# EAGLE design NSL_CylonII (EAGLE 5.10)

## Sheet 1 of 3
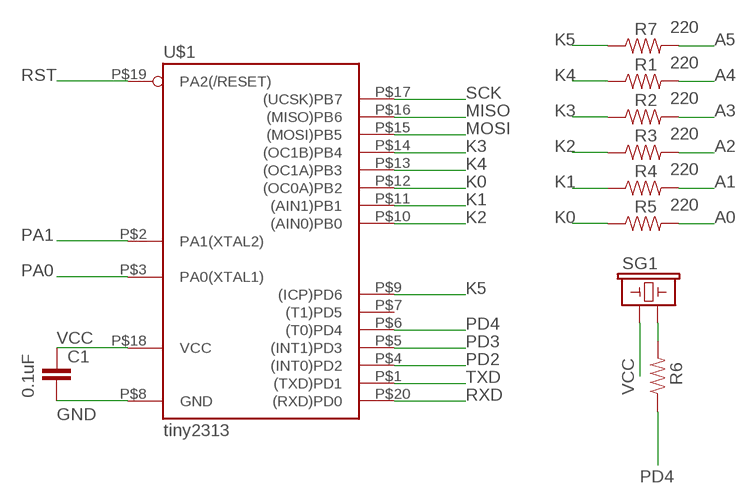
[diagram p0: schematic, sheet 1]

### Parts
C1  0.1uF  CAP0603-CAP  [0603-CAP]
R1  220  RESISTOR1206  [1206]
R2  220  RESISTOR1206  [1206]
R3  220  RESISTOR1206  [1206]
R4  220  RESISTOR1206  [1206]
R5  220  RESISTOR1206  [1206]
R6  RESISTOR1206  [1206]
R7  220  RESISTOR1206  [1206]
SG1  BUZZERSMD2  [BUZZER-CCV]
U$1  tiny2313  TINY2313-*M*  [MLF20]

### Nets
A0 [LED]: R5.2 ; also sheet 3
A1: R4.2 ; also sheet 3
A2: R3.2 ; also sheet 3
A3: R2.2 ; also sheet 3
A4: R1.2 ; also sheet 3
A5: R7.2 ; also sheet 3
GND: C1.2 U$1.P$8(GND) ; also sheet 2
K0 [LED]: R5.1 U$1.P$12((OC0A)PB2)
K1 [LED]: R4.1 U$1.P$11((AIN1)PB1)
K2 [LED]: R3.1 U$1.P$10((AIN0)PB0)
K3 [LED]: R2.1 U$1.P$14((OC1B)PB4)
K4 [LED]: R1.1 U$1.P$13((OC1A)PB3)
K5: R7.1 U$1.P$9((ICP)PD6)
MISO: U$1.P$16((MISO)PB6) ; also sheet 2
MOSI: U$1.P$15((MOSI)PB5) ; also sheet 2
N$4: R6.2 SG1.-
PA0: U$1.P$3(PA0(XTAL1)) ; also sheet 2
PA1: U$1.P$2(PA1(XTAL2)) ; also sheet 2
PD2: U$1.P$4((INT0)PD2) ; also sheet 2
PD3: U$1.P$5((INT1)PD3)
PD4: R6.1 U$1.P$6((T0)PD4)
RST: U$1.P$19(PA2(/RESET)) ; also sheet 2
RXD: U$1.P$20((RXD)PD0)
SCK: U$1.P$17((UCSK)PB7) ; also sheet 2
TXD: U$1.P$1((TXD)PD1)
VCC: C1.1 SG1.+ U$1.P$18(VCC) ; also sheet 2
Unconnected: U$1.P$7((T1)PD5)

## Sheet 2 of 3
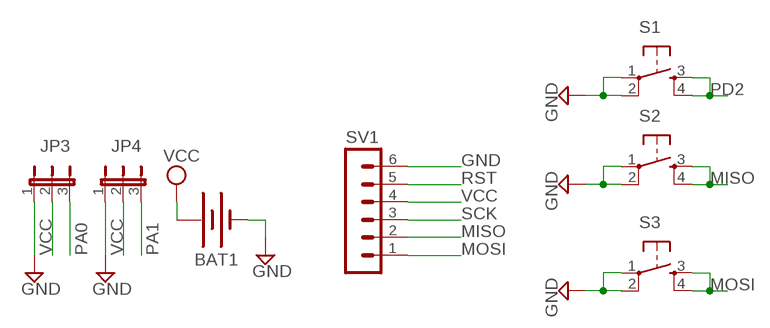
[diagram p1: schematic, sheet 2]

### Parts
BAT1  SPARKFUN_BATTERY20SMD  [SPARKFUN_BATTCON_20MM]
JP3  JUMPER-3PTH  [1X03]
JP4  JUMPER-3PTH  [1X03]
S1  TAC_SWITCHSMD  [TACTILE_SWITCH_SMD]
S2  TAC_SWITCHSMD  [TACTILE_SWITCH_SMD]
S3  TAC_SWITCHSMD  [TACTILE_SWITCH_SMD]
SV1  MA06-1  [MA06-1]

### Nets
GND: BAT1.2(-) JP3.1 JP4.1 S1.1 S1.2 S2.1 S2.2 S3.1 S3.2 SV1.6 ; also sheet 1
MISO: S2.3 S2.4 SV1.2 ; also sheet 1
MOSI: S3.3 S3.4 SV1.1 ; also sheet 1
PA0: JP3.3 ; also sheet 1
PA1: JP4.3 ; also sheet 1
PD2: S1.3 S1.4 ; also sheet 1
RST: SV1.5 ; also sheet 1
SCK: SV1.3 ; also sheet 1
VCC: BAT1.1(+) JP3.2 JP4.2 SV1.4 ; also sheet 1

## Sheet 3 of 3
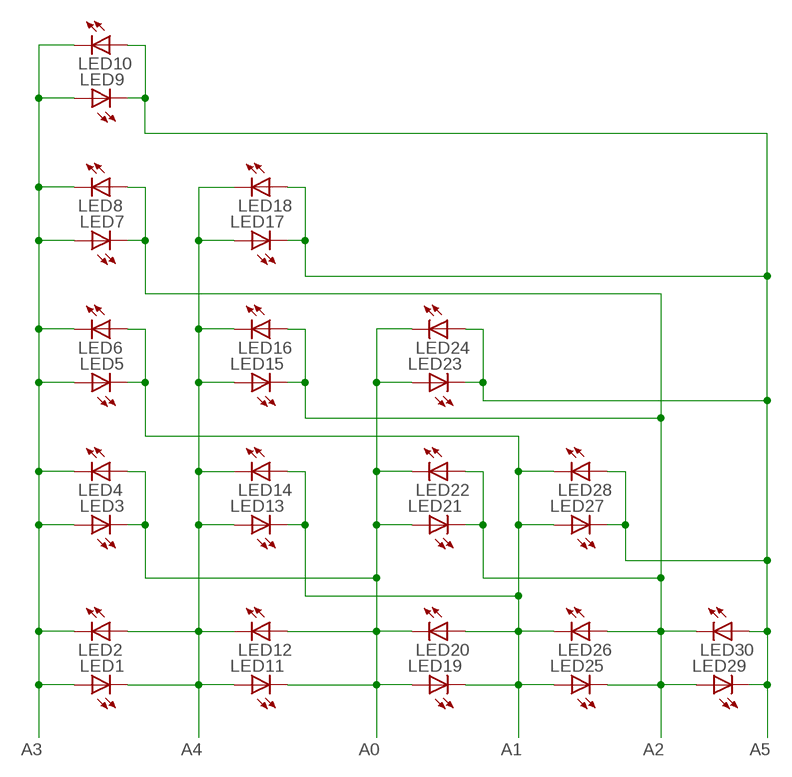
[diagram p2: schematic, sheet 3]

### Parts
LED1  LEDCHIPLED_1206  [CHIPLED_1206]
LED2  LEDCHIPLED_1206  [CHIPLED_1206]
LED3  LEDCHIPLED_1206  [CHIPLED_1206]
LED4  LEDCHIPLED_1206  [CHIPLED_1206]
LED5  LEDCHIPLED_1206  [CHIPLED_1206]
LED6  LEDCHIPLED_1206  [CHIPLED_1206]
LED7  LEDCHIPLED_1206  [CHIPLED_1206]
LED8  LEDCHIPLED_1206  [CHIPLED_1206]
LED9  LEDCHIPLED_1206  [CHIPLED_1206]
LED10  LEDCHIPLED_1206  [CHIPLED_1206]
LED11  LEDCHIPLED_1206  [CHIPLED_1206]
LED12  LEDCHIPLED_1206  [CHIPLED_1206]
LED13  LEDCHIPLED_1206  [CHIPLED_1206]
LED14  LEDCHIPLED_1206  [CHIPLED_1206]
LED15  LEDCHIPLED_1206  [CHIPLED_1206]
LED16  LEDCHIPLED_1206  [CHIPLED_1206]
LED17  LEDCHIPLED_1206  [CHIPLED_1206]
LED18  LEDCHIPLED_1206  [CHIPLED_1206]
LED19  LEDCHIPLED_1206  [CHIPLED_1206]
LED20  LEDCHIPLED_1206  [CHIPLED_1206]
LED21  LEDCHIPLED_1206  [CHIPLED_1206]
LED22  LEDCHIPLED_1206  [CHIPLED_1206]
LED23  LEDCHIPLED_1206  [CHIPLED_1206]
LED24  LEDCHIPLED_1206  [CHIPLED_1206]
LED25  LEDCHIPLED_1206  [CHIPLED_1206]
LED26  LEDCHIPLED_1206  [CHIPLED_1206]
LED27  LEDCHIPLED_1206  [CHIPLED_1206]
LED28  LEDCHIPLED_1206  [CHIPLED_1206]
LED29  LEDCHIPLED_1206  [CHIPLED_1206]
LED30  LEDCHIPLED_1206  [CHIPLED_1206]

### Nets
A0 [LED]: LED3.C LED4.A LED11.C LED12.A LED19.A LED20.C LED21.A LED22.C LED23.A LED24.C ; also sheet 1
A1: LED5.C LED6.A LED13.C LED14.A LED19.C LED20.A LED25.A LED26.C LED27.A LED28.C ; also sheet 1
A2: LED7.C LED8.A LED15.C LED16.A LED21.C LED22.A LED25.C LED26.A LED29.A LED30.C ; also sheet 1
A3: LED1.A LED2.C LED3.A LED4.C LED5.A LED6.C LED7.A LED8.C LED9.A LED10.C ; also sheet 1
A4: LED1.C LED2.A LED11.A LED12.C LED13.A LED14.C LED15.A LED16.C LED17.A LED18.C ; also sheet 1
A5: LED9.C LED10.A LED17.C LED18.A LED23.C LED24.A LED27.C LED28.A LED29.C LED30.A ; also sheet 1

## Library data of the parts
BAT1 = NSL:SPARKFUN_BATTERY: Battery Holders Various common sizes : AA, AAA, 20mm coin cell and 12mm coin cell.
C1 = SparkFun:CAP: Capacitor Standard 0603 ceramic capacitor, and 0.1" leaded capacitor.
JP3 JP4 = SparkFun:JUMPER-3
LED1-LED30 = led:LED: LED OSRAM: - CHIPLED LG R971, LG N971, LY N971, LG Q971, LY Q971, LO R971, LY R971 LH N974, LH R974 LS Q976, LO Q976, LY Q976 LO Q996 - Hyper CHIPLED LW Q18S LB Q993, LB Q99A, LB R99A - SideLED LS A670, LO A670, LY A670, LG A670, LP A670 LB A673, LV A673, LT A673, LW A673 LH A674 LY A675 LS A676, LA A676, LO A676, LY A676, LW A676 LS A679, LY A679, LG A679 - Hyper Micro SIDELED® LS Y876, LA Y876, LO Y876, LY Y876 LT Y87S - SmartLED LW L88C, LW L88S LB L89C, LB L89S, LG L890 LS L89K, LO L89K, LY L89K LS L896, LA L896, LO L896, LY L896 - TOPLED LS T670, LO T670, LY T670, LG T670, LP T670 LSG T670, LSP T670, LSY T670, LOP T670, LYG T670 LG T671, LOG T671, LSG T671 LB T673, LV T673, LT T673, LW T673 LH T674 LS T676, LA T676, LO T676, LY T676, LB T676, LH T676, LSB T676, LW T676 LB T67C, LV T67C, LT T67C, LS T67K, LO T67K, LY T67K, LW E67C LS E67B, LA E67B, LO E67B, LY E67B, LB E67C, LV E67C, LT E67C LW T67C LS T679, LY T679, LG T679 LS T770, LO T770, LY T770, LG T770, LP T770 LB T773, LV T773, LT T773, LW T773 LH T774 LS E675, LA E675, LY E675, LS T675 LS T776, LA T776, LO T776, LY T776, LB T776 LHGB T686 LT T68C, LB T68C - Hyper Mini TOPLED® LB M676 - Mini TOPLED Santana® LG M470 LS M47K, LO M47K, LY M47K Source: http://www.osram.convergy.de LUXEON: - LUMILED® LXK2-PW12-R00, LXK2-PW12-S00, LXK2-PW14-U00, LXK2-PW14-V00 LXK2-PM12-R00, LXK2-PM12-S00, LXK2-PM14-U00 LXK2-PE12-Q00, LXK2-PE12-R00, LXK2-PE12-S00, LXK2-PE14-T00, LXK2-PE14-U00 LXK2-PB12-K00, LXK2-PB12-L00, LXK2-PB12-M00, LXK2-PB14-N00, LXK2-PB14-P00, LXK2-PB14-Q00 LXK2-PR12-L00, LXK2-PR12-M00, LXK2-PR14-Q00, LXK2-PR14-R00 LXK2-PD12-Q00, LXK2-PD12-R00, LXK2-PD12-S00 LXK2-PH12-R00, LXK2-PH12-S00 LXK2-PL12-P00, LXK2-PL12-Q00, LXK2-PL12-R00 Source: www.luxeon.com KINGBRIGHT: KA-3528ASYC Source: www.kingbright.com
R1-R5 R7 = NSL:RESISTOR: Resistor Basic schematic elements and footprints for 0603, 1206, and PTH 1/10th watt (small) resistors.
R6 = SparkFun:RESISTOR: Resistor Basic schematic elements and footprints for 0603, 1206, and PTH 1/10th watt (small) resistors.
S1-S3 = SparkFun:TAC_SWITCH: Momentary Switch Button commonly used for reset or general input. Spark Fun Electronics SKU : COM-00097
SG1 = SparkFun:BUZZER: Buzzer 12mm Spark Fun Electronics SKU : Comp-Buzzer
SV1 = NSL:MA06-1: PIN HEADER
U$1 = NSL_Cylon:TINY2313*: Atmel Tiny2313 2K Flash, 128 bytes EEPROM, 128 bytes RAM

## Net classes
1 LED: width 0.203 mm

## Board
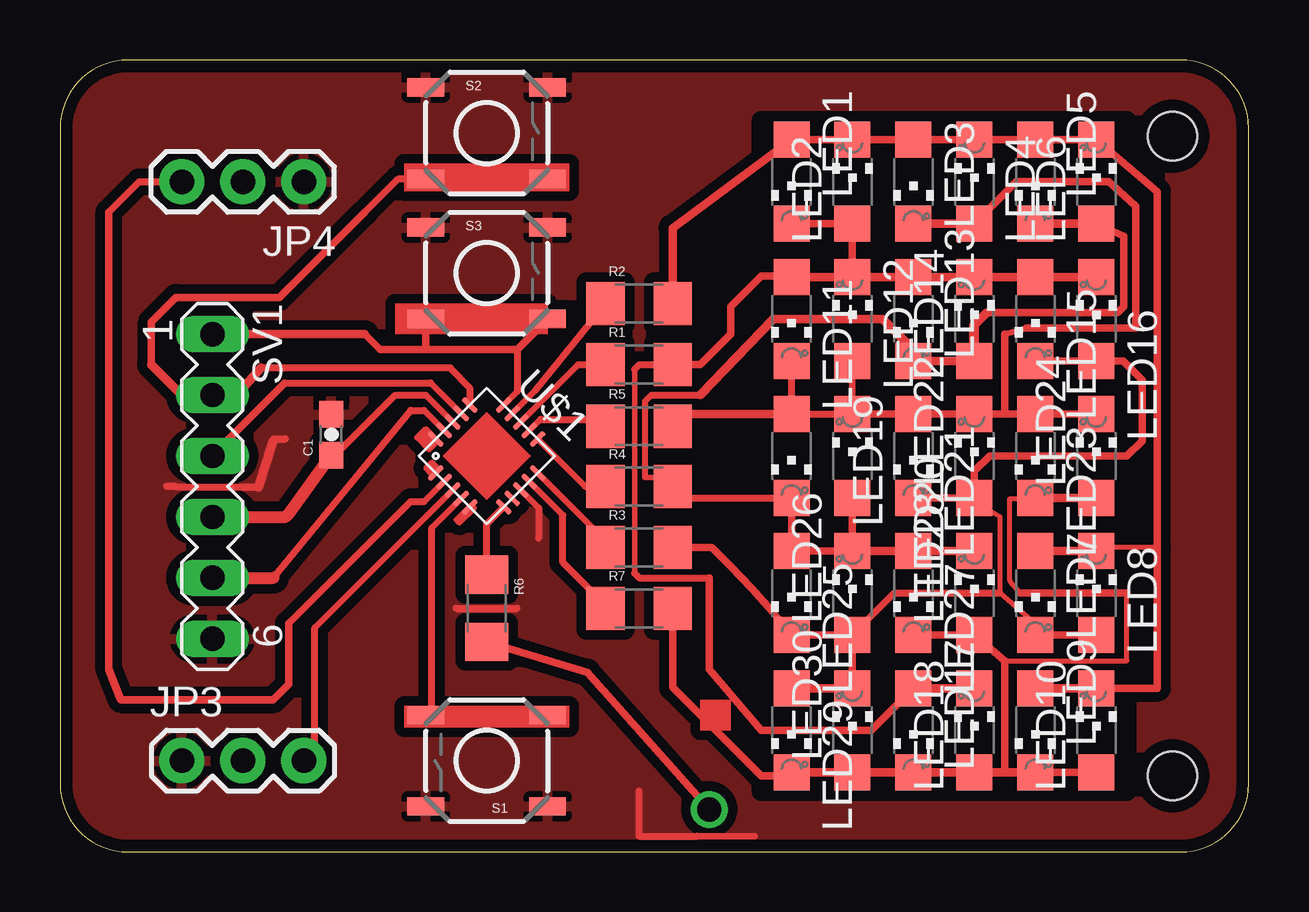
[diagram p3: board, top side]
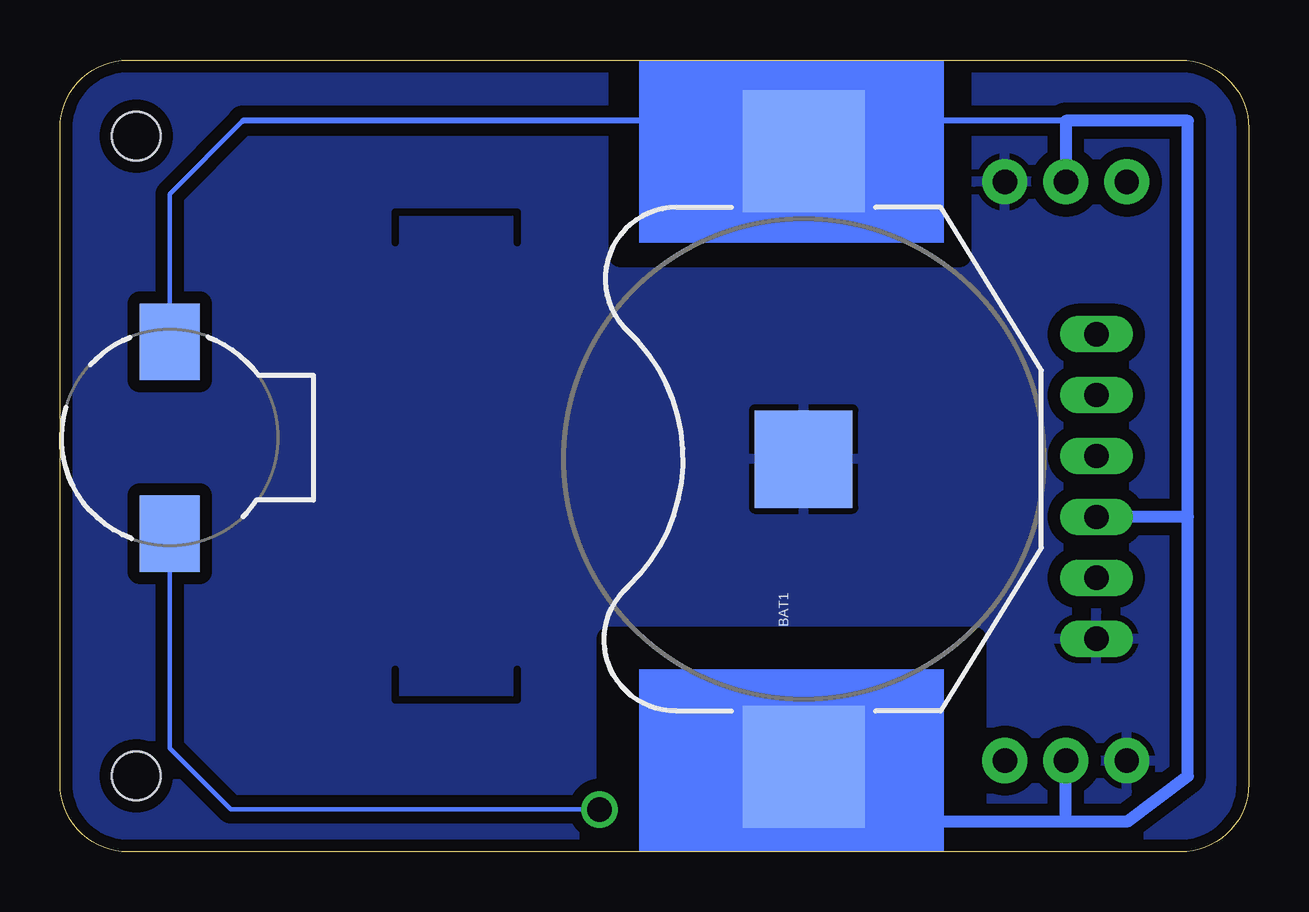
[diagram p4: board, bottom side, seen from below]

Size 49.53 x 33.02 mm. Coordinates in mm from the lower left corner, seen from the top.
Outline: 49.53,30.18 arc90 46.69,33.02 2.84,33.02 arc90 0,30.18 0,2.84 arc90 2.84,0 46.69,0 arc90 49.53,2.84 49.53,30.18
Copper layers (1*16): Top 0.0356mm / dielectric 1.5011mm / Bottom 0.0356mm
Design rules "SilverCircuits": minimum track width 7mil, minimum drill 14mil, track to track 7mil, track to pad 7mil, pad to pad 7mil, via to via 7mil, smd to smd 0mil, copper to edge 20mil, drill to drill 8mil, minimum pad ring 10mil, minimum via ring 8mil, stop-mask expansion 4mil, vias tented up to drill 0mil, thermal gap 10mil
Holes 2.03 mm at 46.36,29.84 46.36,3.17
tRestrict: area 29.2,2.5 to 44.5,30.5
bRestrict: area 12.1,24.9 to 26.2,32.4; area 11.4,0 to 25.4,7.6; area 25.4,0 to 26.7,7.6; area 11.4,7.6 to 26.7,8.9; 6 lines
Milling: 8 lines

### Footprints (pad centres in the part's own frame; a part is rotated, then mirrored left to right if it is on the bottom)
SPARKFUN_BATTCON_20MM = smd 5.08 x 5.08: 1 -12.827,0; 3 12.827,0 | smd 4.064 x 4.064: 2 0,0
0603-CAP = smd 1.1 x 1: 1 -0.85,0; 2 0.85,0
1X03 = drill 1.016 pad 1.88 round: 1 0,0; 2 2.54,0; 3 5.08,0
CHIPLED_1206 = smd 1.5 x 1.5: A 0,-1.75; C 0,1.75
1206 = smd 1.6 x 1.8: 1 -1.4,0; 2 1.4,0
TACTILE_SWITCH_SMD = smd 1.524 x 0.762: 1 -2.54,1.905; 2 2.54,1.905; 3 -2.54,-1.905; 4 2.54,-1.905
BUZZER-CCV = smd 3.2 x 2.5: + 4,0; - -4,0
MA06-1 = drill 1.016 long: 1 -6.35,0; 2 -3.81,0; 3 -1.27,0; 4 1.27,0; 5 3.81,0; 6 6.35,0
MLF20 = smd 0.8 x 0.23: P$1 -2,1; P$2 -2,0.5; P$3 -2,0; P$4 -2,-0.5; P$5 -2,-1; P$11 2,-1; P$12 2,-0.5; P$13 2,0; P$14 2,0.5; P$15 2,1 | smd 0.23 x 0.8: P$6 -1,-2; P$7 -0.5,-2; P$8 0,-2; P$9 0.5,-2; P$10 1,-2; P$16 1,2; P$17 0.5,2; P$18 0,2; P$19 -0.5,2; P$20 -1,2

### Placement (x,y rotation side)
BAT1  18.54,16.38 90 bottom
C1  11.3,17.4 90 top
JP3  5.08,3.81 0 top
JP4  10.16,27.94 180 top
LED1  30.48,27.94 180 top
LED2  33.02,27.94 0 top
LED3  35.56,27.94 180 top
LED4  38.1,27.94 0 top
LED5  40.64,27.94 180 top
LED6  43.18,27.94 0 top
LED7  40.64,10.79 180 top
LED8  43.18,10.79 0 top
LED9  40.64,5.08 180 top
LED10  43.18,5.08 0 top
LED11  30.48,22.22 180 top
LED12  33.02,22.22 0 top
LED13  35.56,22.22 180 top
LED14  38.1,22.22 0 top
LED15  40.64,22.22 180 top
LED16  43.18,22.22 0 top
LED17  35.56,5.08 180 top
LED18  38.1,5.08 0 top
LED19  30.48,16.51 180 top
LED20  33.02,16.51 0 top
LED21  35.56,16.51 180 top
LED22  38.1,16.51 0 top
LED23  40.64,16.51 180 top
LED24  43.18,16.51 0 top
LED25  30.48,10.79 180 top
LED26  33.02,10.79 0 top
LED27  35.56,10.79 180 top
LED28  38.1,10.79 0 top
LED29  30.48,5.08 180 top
LED30  33.02,5.08 0 top
R1  24.13,20.32 0 top
R2  24.13,22.86 0 top
R3  24.13,12.7 0 top
R4  24.13,15.24 0 top
R5  24.13,17.75 0 top
R6  17.78,10.16 270 top
R7  24.13,10.16 0 top
S1  17.78,3.81 180 top
S2  17.78,29.97 0 top
S3  17.78,24.13 0 top
SG1  44.96,17.27 90 bottom
SV1  6.35,15.24 270 top
U$1  17.78,16.51 45 top

### Tracks (layer width: path | path; a pad name or v marks a point on that pad's centre or on a via)
A0
  Top 0.203: LED11.C 30.48,20.95 | LED12.A 33.12,20.47 33.02,20.38 LED12.A | LED12.A 33.37,20.47 | LED12.A 33.02,20.45 | LED20.C 33.02,18.16 32.92,18.26
  Top 0.254: 39.37,21.59 40.26,21.84
  Top 0.279: LED20.C 33.02,20.38
  Top 0.292: R5.2 26.04,18.26 | LED11.C LED19.A 32.92,18.26
  Top 0.305: 40.26,21.84 44.83,21.84 44.83,26.92 43.69,27.94 39.85,27.94 LED4.A | 33.02,18.16 33.02,17.78 | LED24.C LED23.A 39.37,18.26 | 39.37,18.26 LED22.C LED21.A LED20.C | 39.37,18.26 39.37,21.59
  Top 0.356: LED4.A LED3.C | 26.04,18.26 LED19.A
A1
  Top 0.229: 24.38,18.8 24.64,19.05 | 25.15,15.62 24.38,15.62
  Top 0.254: 24.38,15.62 24.38,18.8
  Top 0.292: LED19.C 26.01,14.76 R4.2 25.15,15.62 | 24.64,19.05 26.67,19.05
  Top 0.305: 35.56,20.95 LED13.C | 38.61,22.48 44.07,22.48 44.32,22.73 44.32,25.68 LED6.A | LED19.C LED25.A LED26.C LED20.A
  Top 0.356: LED6.A LED5.C | LED13.C LED14.A | 35.56,20.95 34.29,22.22 29.72,22.22 26.67,19.05 | 38.1,21.97 38.61,22.48 | LED28.C LED27.A LED26.C
  Top 0.406: LED14.A 38.1,21.97
A2
  Top 0.203: LED7.C 40.64,9.52 39.17,10.79 39.17,13.97 38.1,14.6 LED22.A
  Top 0.292: LED26.A 34.77,10.79 39.17,10.79
  Top 0.305: LED16.A LED15.C 44.3,20.47 45.09,19.68 45.09,17.14 44.45,16.51 38.73,16.51 38.1,15.88 LED22.A LED21.C | R3.2 27.15,12.7 27.94,11.91 arc-7 LED25.C LED26.A LED30.C | LED7.C LED8.A
  Top 0.356: LED29.A LED30.C
A3
  Top 0.203: LED8.C 43.34,12.7 45.72,12.7
  Top 0.305: LED1.A LED2.C LED3.A LED4.C LED5.A LED6.C 45.72,27.53 45.72,12.7 45.72,6.83 LED10.C
  Top 0.356: LED9.A LED10.C | LED1.A 25.53,26.01 R2.2 | LED8.C LED7.A
A4
  Top 0.203: LED14.C 38.1,23.49
  Top 0.229: 23.94,11.62 23.94,20.13
  Top 0.292: 23.94,11.62 24.13,11.43 27.05,11.43 | 23.94,20.13 24.13,20.32 R1.2 | 30.45,24 LED11.A
  Top 0.305: LED1.C LED2.A LED12.C | 27.05,11.43 27.05,7.62 29.21,5.08 33.81,5.08 LED17.A | R1.2 26.67,20.32 27.94,21.59 27.94,22.73 29.21,24 30.45,24
  Top 0.356: LED16.C LED15.A LED14.C LED13.A LED12.C LED11.A | LED17.A LED18.C
A5
  Top 0.203: 39.37,7.98 44.45,7.98 44.45,10.79 | 40.01,10.79 39.57,11.3 39.57,14.73 40.64,14.73 LED23.C
  Top 0.305: LED9.C LED10.A | R7.2 25.53,6.85 29.21,3.17 30,3.17 LED29.C | LED27.C LED28.A 39.37,7.98 39.37,3.33 | 44.45,10.79 40.01,10.79
  Top 0.356: LED9.C 39.37,3.33 LED18.A LED17.C LED30.A LED29.C | LED23.C LED24.A
GND
  Top 0.254: U$1.P$8 19.94,14.35
  Top 0.279: 26.54,0.66 28.96,0.66
  Top 0.292: 8.89,17.14 8.89,17.22 9.4,17.22 | 8.28,15.21 5.11,15.21 4.81,15.24 4.45,15.24 | 19.94,14.35 19.94,13.08 | 26.54,0.66 24.13,0.66 24.13,2.54 | 16.51,10.16 19.05,10.16
  Top 0.381: 8.28,15.21 8.89,17.14
  pour Top (isolate 0.406): 2.54,33.02 arc90 0,30.48 0,2.84 arc90 2.84,0 46.69,0 arc90 49.53,2.84 49.53,30.18 arc90 46.69,33.02
  pour Bottom (isolate 0.508): 2.84,33.02 arc90 0,30.18 0,2.84 arc90 2.84,0 46.69,0 arc90 49.53,2.84 49.53,30.18 arc90 46.69,33.02
K0
  Top 0.203: 22.77,17.75 R5.1
  Top 0.254: U$1.P$12 20.01,18.03
  Top 0.292: 20.01,18.03 22.48,18.03 22.77,17.75
K1
  Top 0.254: U$1.P$11 21.88,15.24
  Top 0.292: 21.88,15.24 R4.1
K2
  Top 0.203: R3.1 23,12.7
  Top 0.254: 23,12.7 U$1.P$10
K3
  Top 0.254: U$1.P$14 19.81,19.25
  Top 0.292: 19.81,19.25 R2.1
K4
  Top 0.254: U$1.P$13 21.59,20.32
  Top 0.292: 21.59,20.32 R1.1
K5
  Top 0.203: R7.1 22.73,10.29
  Top 0.254: 20.95,14.04 U$1.P$9
  Top 0.292: 20.95,14.04 20.95,12.06 22.73,10.29
MISO
  Top 0.292: S2.4 S2.3 14.1,28.07 12.7,26.67 | U$1.P$16 17.07,19.35 16.26,20.17
  Top 0.305: 8.38,20.19 16.26,20.17 | 3.81,20.32 3.81,22.1 4.83,23.11 9.14,23.11 12.7,26.67
  Top 0.381: 8.38,20.19 7.37,19.05 SV1.2 5.08,19.05 3.81,20.32
MOSI
  Top 0.254: 19.05,19.19 U$1.P$15
  Top 0.292: 12.7,21.59 13.34,20.95 | 19.05,20.95 19.05,19.19
  Top 0.305: 13.34,20.95 15.24,20.95 | 15.24,20.95 19.05,20.95 S3.4 | 15.24,20.95 S3.3
  Top 0.356: SV1.1 12.7,21.59
N$1
  pour Bottom: 29.21,27.94 29.21,5.08 36.83,5.08 36.83,27.94
N$2
  Top 0.203: 15.24,17.65 15.75,17.14 15.37,16.76 14.86,17.27 15.24,17.65
N$3
  Top 0.203: 15.75,16 15.49,16.26 15.24,16 15.49,15.75 15.49,16.13 15.62,16 15.37,16
N$4  (via drill 1.02)
  Top 0.305: R6.2 21.97,7.49 v27.05,1.78
  Bottom 0.178: v27.05,1.78 42.42,1.78 44.96,4.32 SG1.-
N$5
  Top 0.203: 15.24,17.53 15.49,17.14 15.37,17.02 14.99,17.27 15.11,17.4 15.37,17.14
N$6
  Top 0.203: 17.15,14.48 16.51,13.84 16.64,13.72 17.27,14.35
PA0
  Top 0.203: JP3.3 10.62,3.81
  Top 0.254: 10.62,9.35 U$1.P$3
  Top 0.292: 10.62,3.81 10.62,9.35
PA1
  Top 0.254: 15.17,14.6 U$1.P$2
  Top 0.292: 9.53,9.52 14.61,14.6 15.17,14.6 | JP4.3 3.3,27.94 2.03,26.67
  Top 0.305: 9.53,9.52 9.53,6.98 8.89,6.35 2.54,6.35 2.03,7.62 2.03,26.67
PD2
  Top 0.254: 15.49,13.52 U$1.P$4
  Top 0.292: 15.49,5.59 15.49,13.52 | S1.4 15.49,5.59 | 15.49,5.59 19.94,5.59 S1.3
PD4
  Top 0.292: U$1.P$6 17.78,13.68 R6.1
RST
  Top 0.254: 15.17,18.41 U$1.P$19
  Top 0.292: 14.61,18.41 15.17,18.41
  Top 0.305: 8.89,11.43 14.61,18.41
  Top 0.508: SV1.5 8.89,11.43
SCK
  Top 0.254: 15.44,19.56 U$1.P$17 | SV1.3 6.35,16.53
  Top 0.292: 9.37,19.56 15.44,19.56
  Top 0.305: 6.35,16.53 9.37,19.56
VCC
  Top 0.254: 15.24,19.05 U$1.P$18
  Top 0.292: 15.24,19.05 13.97,19.05 10.58,15.66
  Top 0.381: C1.1 10.58,15.66
  Top 0.508: SV1.4 9.4,13.97 9.53,14.1 C1.1
  Bottom 0.178: 17.78,1.27 18.54,2.03 BAT1.1 | SG1.+ 44.96,27.43 41.91,30.48
  Bottom 0.254: 7.62,30.48 41.91,30.48
  Bottom 0.508: 2.54,13.97 2.54,30.48 7.62,30.48 JP4.2 | 2.54,13.97 SV1.4 | 2.54,13.97 2.54,3.17 5.08,1.27 7.62,1.27 | 7.62,1.27 JP3.2 | 7.62,1.27 17.78,1.27
(copper drawn outside any net)
  shapes: Bottom area x6, Top area x8

### Text on the board
bRestrict: NULLSPACE | LABS
_tsilk: HULALGAGULHUAUL | nullspacelabs.com | [NSL] Cylon II | IO | 3V | 0.1uF | 3V | krs | charliex | G | 3V | IO